# Altium schematic sheet SIM7100.SchDoc
size A4
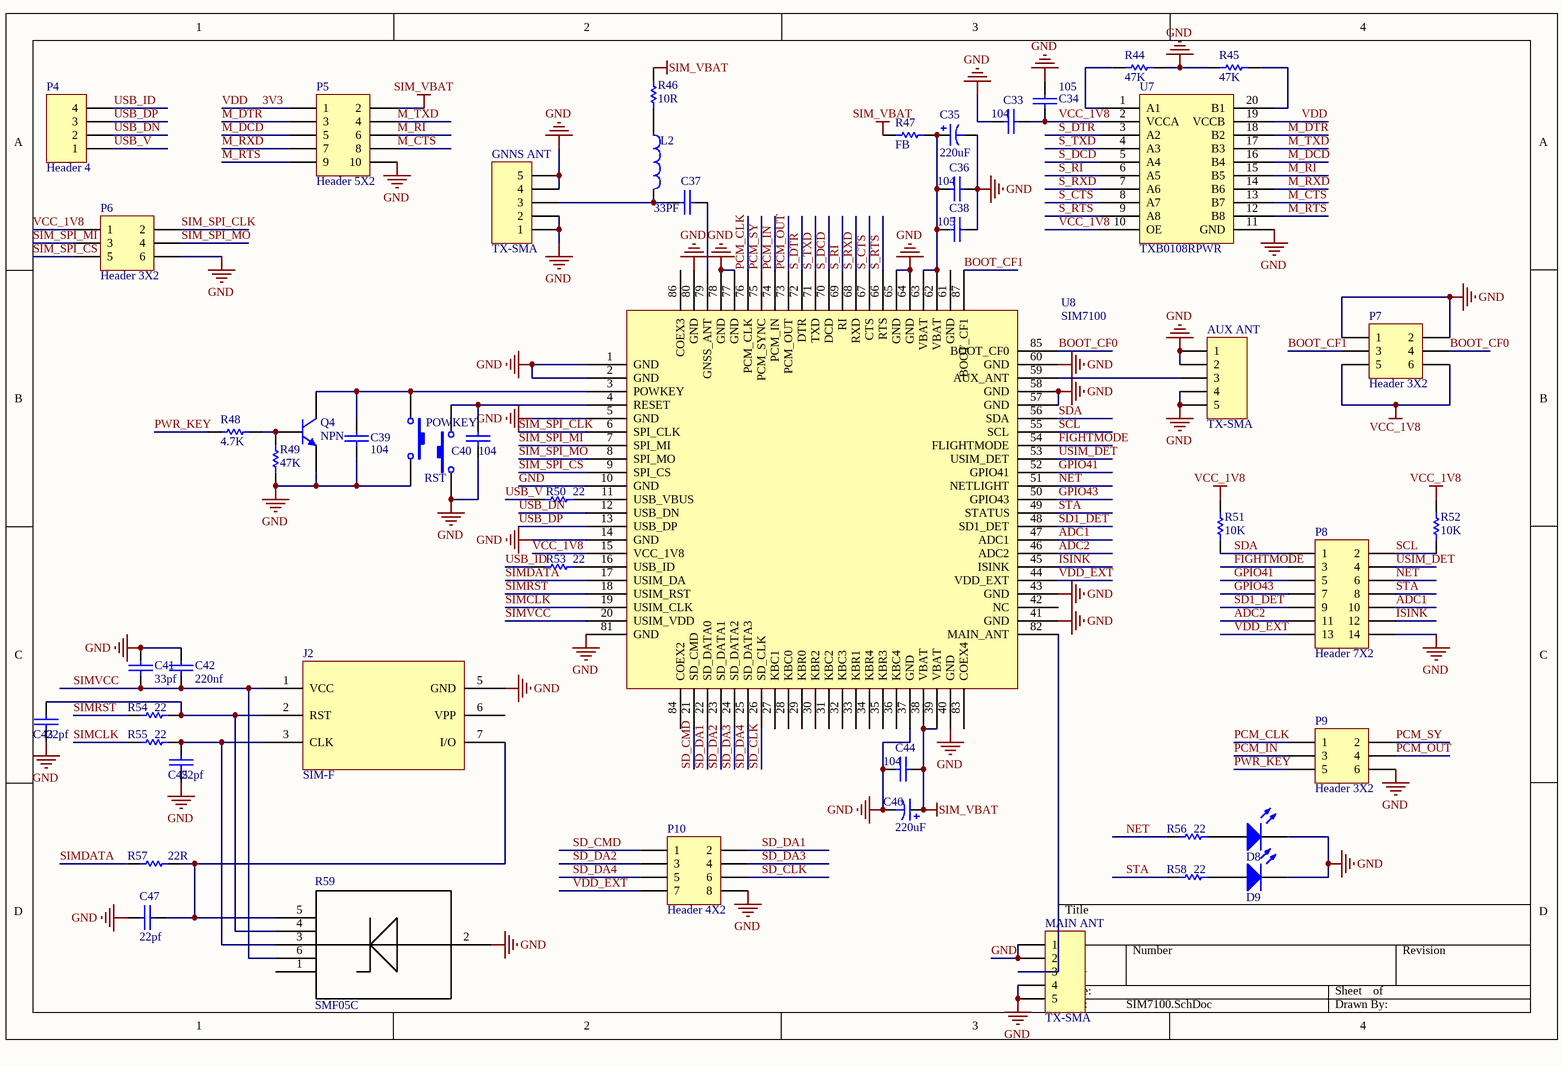
[diagram p0: SIM7100.SchDoc]

## Parts
AUX_ANT  TX-SMA  [SMA]
C33  104  [RC0805]
C34  105  [RC0805]
C35  value 220uF  [CAP(100uF)]  (hidden comment: 407uF)
C36  104  [RC0805]
C37  33PF  [RC0805]
C38  105  [RC0805]
C39  104  [RC0805]
C40  104  [RC0805]
C41  33pf  [RC0805]
C42  220nf  [RC0805]
C43  22pf  [RC0805]
C44  104  [RC0805]
C45  22pf  [RC0805]
C46  value 220uF  [CAP(100uF)]  (hidden comment: 407uF)
C47  22pf  [RC0805]
D8  LED0  [LED-0805]  (value not drawn)
D9  LED0  [LED-0805]  (value not drawn)
GNNS_ANT  TX-SMA  [SMA]
J2  SIM-F  [SIM_FG]
L2  Inductor  [RC0805]  (value not drawn)
MAIN_ANT  TX-SMA  [SMA]
P4  Header 4  [HDR1X4]
P5  Header 5X2  [HDR2X5]
P6  Header 3X2  [HDR2X3]
P7  Header 3X2  [HDR2X3]
P8  Header 7X2  [HDR2X7]
P9  Header 3X2  [HDR2X3]
P10  Header 4X2  [HDR2X4]
POWKEY  SW-PB  [小按键]  (value not drawn)
Q4  NPN  [to-92a]
R44  value 47K  [RC0805]  (hidden comment: Res1)
R45  value 47K  [RC0805]  (hidden comment: Res1)
R46  value 10R  [RC0805]  (hidden comment: Res1)
R47  value FB  [1206]  (hidden comment: Res1)
R48  value 4.7K  [RC0805]  (hidden comment: Res1)
R49  value 47K  [RC0805]  (hidden comment: Res1)
R50  value 22  [RC0805]  (hidden comment: Res1)
R51  value 10K  [RC0805]  (hidden comment: Res1)
R52  value 10K  [RC0805]  (hidden comment: Res1)
R53  value 22  [RC0805]  (hidden comment: Res1)
R54  value 22  [RC0805]  (hidden comment: Res1)
R55  value 22  [RC0805]  (hidden comment: Res1)
R56  value 22  [RC0805]  (hidden comment: Res1)
R57  value 22R  [RC0805]  (hidden comment: Res1)
R58  value 22  [RC0805]  (hidden comment: Res1)
R59  SMF05C  [SOT-363]
RST  SW-PB  [小按键]  (value not drawn)
U7  TXB0108RPWR  [R-PDSO-20]
U8  SIM7100  [SIM7100]

## Nets
GND: AUX_ANT.1 AUX_ANT.2 AUX_ANT.4 AUX_ANT.5 C33.1 C34.2 C35.2 C36.2 C38.2 C39.2 C40.2 C41.2 C42.2 C43.1 C44.1 C45.1 C46.2 C47.2 D8.2(K) D9.2(K) GNNS_ANT.1 GNNS_ANT.2 GNNS_ANT.4 GNNS_ANT.5 J2.5(GND) MAIN_ANT.1 MAIN_ANT.2 MAIN_ANT.4 MAIN_ANT.5 P5.10 P6.6 P7.1 P7.2 P8.14 P9.6 P10.8 POWKEY.2 Q4.1(E) R44.1 R45.2 R49.1 R59.2(I/O) RST.1 U7.11(GND) U8.1(GND) U8.2(GND) U8.5(GND) U8.10(GND) U8.14(GND) U8.37(GND) U8.40(GND) U8.41(GND) U8.43(GND) U8.57(GND) U8.58(GND) U8.60(GND) U8.64(GND) U8.65(GND) U8.77(GND) U8.78(GND) U8.80(GND) U8.81(GND)
SIM_VBAT: C44.2 C46.1 P5.2 R46.2 R47.1 U8.38(VBAT) U8.39(VBAT)
VCC_1V8: C33.2 C34.1 P6.1 P7.5 P7.6 R51.2 R52.2 U7.2(VCCA) U7.10(OE) U8.15(VCC_1V8)
3V3: P5.1 U7.19(VCCB)  [also labelled VDD]
ADC1: P8.10 U8.47(ADC1)
ADC2: P8.11 U8.46(ADC2)
BOOT_CF0: P7.4 U8.85(BOOT_CF0)
BOOT_CF1: P7.3 U8.87(BOOT_CF1)
FIGHTMODE: P8.3 U8.54(FLIGHTMODE)
GPIO41: P8.5 U8.52(GPIO41)
GPIO43: P8.7 U8.50(GPIO43)
ISINK: P8.12 U8.45(ISINK)
M_CTS: P5.8 U7.13(B7)
M_DCD: P5.5 U7.16(B4)
M_DTR: P5.3 U7.18(B2)
M_RI: P5.6 U7.15(B5)
M_RTS: P5.9 U7.12(B8)
M_RXD: P5.7 U7.14(B6)
M_TXD: P5.4 U7.17(B3)
NET: P8.6 R56.1 U8.51(NETLIGHT)
PCM_CLK: P9.1 U8.76(PCM_CLK)
PCM_IN: P9.3 U8.74(PCM_IN)
PCM_OUT: P9.4 U8.73(PCM_OUT)
PCM_SY: P9.2 U8.75(PCM_SYNC)
PWR_KEY: P9.5 R48.1
S_CTS: U7.8(A7) U8.67(CTS)
S_DCD: U7.5(A4) U8.70(DCD)
S_DTR: U7.3(A2) U8.72(DTR)
S_RI: U7.6(A5) U8.69(RI)
S_RTS: U7.9(A8) U8.66(RTS)
S_RXD: U7.7(A6) U8.68(RXD)
S_TXD: U7.4(A3) U8.71(TXD)
SCL: P8.2 R52.1 U8.55(SCL)
SD1_DET: P8.9 U8.48(SD1_DET)
SD_CLK: P10.6 U8.26(SD_CLK)
SD_CMD: P10.1 U8.21(SD_CMD)
SD_DA1: P10.2 U8.22(SD_DATA0)
SD_DA2: P10.3 U8.23(SD_DATA1)
SD_DA3: P10.4 U8.24(SD_DATA2)
SD_DA4: P10.5 U8.25(SD_DATA3)
SDA: P8.1 R51.1 U8.56(SDA)
SIM_SPI_CLK: P6.2 U8.6(SPI_CLK)
SIM_SPI_CS: P6.5 U8.9(SPI_CS)
SIM_SPI_MI: P6.3 U8.7(SPI_MI)
SIM_SPI_MO: P6.4 U8.8(SPI_MO)
SIMCLK: R55.1 U8.19(USIM_CLK)
SIMDATA: R57.1 U8.17(USIM_DA)
SIMRST: R54.1 U8.18(USIM_RST)
SIMVCC: C41.1 C42.1 J2.1(VCC) R59.6(I/O) U8.20(USIM_VDD)
STA: P8.8 R58.1 U8.49(STATUS)
USB_DN: P4.2 U8.12(USB_DN)
USB_DP: P4.3 U8.13(USB_DP)
USB_ID: P4.4 R53.1
USB_V: P4.1 R50.1
USIM_DET: P8.4 U8.53(USIM_DET)
VDD_EXT: P8.13 P10.7 U8.44(VDD_EXT)
NetAUX_ANT_3: AUX_ANT.3 U8.59(AUX_ANT)
NetC35_1: C35.1 C36.1 C38.1 R47.2 U8.62(VBAT) U8.63(VBAT)
NetC37_1: C37.1 GNNS_ANT.3 L2.2
NetC37_2: C37.2 U8.79(GNSS_ANT)
NetC39_1: C39.1 POWKEY.1 Q4.3(C) U8.3(POWKEY)
NetC40_1: C40.1 RST.2 U8.4(RESET)
NetC43_2: C43.2 J2.2(RST) R54.2 R59.4(I/O)
NetC45_2: C45.2 J2.3(CLK) R55.2 R59.3(I/O)
NetC47_1: C47.1 J2.7(I/O) R57.2 R59.5(I/O)
NetD8_1: D8.1(A) R56.2
NetD9_1: D9.1(A) R58.2
NetL2_1: L2.1 R46.1
NetMAIN_ANT_3: MAIN_ANT.3 U8.82(MAIN_ANT)
NetQ4_2: Q4.2(B) R48.2 R49.2
NetR44_2: R44.2 U7.1(A1)
NetR45_1: R45.1 U7.20(B1)
NetR50_2: R50.2 U8.11(USB_VBUS)
NetR53_2: R53.2 U8.16(USB_ID)

Not connected (* = marked no-connect by the designer): J2 6(VPP); R59 1(I/O); U8 27(KBC1) 28(KBC0) 29(KBR0) 30(KBR2) 31(KBC2) 32(KBC3) 33(KBR1) 34(KBR4) 35(KBR3) 36(KBC4) 42(NC) 61(GND) 83(COEX4) 84(COEX2) 86(COEX3)

## Library data of the parts
AUX_ANT GNNS_ANT MAIN_ANT = Header 5: Header, 5-Pin; LatestRevisionDate: 17-Jul-2002; LatestRevisionNote: Re-released for DXP Platform.; Publisher: Altium Limited
C33 C34 C36-C45 C47 = CAP: Capacitor
C35 C46 = Cap Pol1: Polarized Capacitor (Radial); Published: 8-Jun-2000; LatestRevisionDate: 17-Jul-2002; LatestRevisionNote: Re-released for DXP Platform.; PackageReference: RB7.6-15; Publisher: Altium Limited
D8 D9 = LED0: Typical INFRARED GaAs LED; Published: 8-Jun-2000; LatestRevisionDate: 08-Jul-2005; LatestRevisionNote: Mech Layer 1 removed.; PackageReference: LED-0; Publisher: Altium Limited; PackageDescription: LED; 2 Leads
L2 = Inductor: Code_IEC: 1005; Value: 10mH; Published: 8-Jun-2000; LatestRevisionDate: 29-May-2009; LatestRevisionNote: IPC-7351 Footprint Added.; PackageReference: 0402-A; Publisher: Altium Limited; PackageDescription: Chip Inductor; Code_JEITA: 0402
P4 = Header 4: Header, 4-Pin; LatestRevisionDate: 17-Jul-2002; LatestRevisionNote: Re-released for DXP Platform.; Publisher: Altium Limited
P5 = Header 5X2: Header, 5-Pin, Dual row; LatestRevisionDate: 17-Jul-2002; LatestRevisionNote: Re-released for DXP Platform.; Publisher: Altium Limited
P6 P7 P9 = Header 3X2: Header, 3-Pin, Dual row; LatestRevisionDate: 17-Jul-2002; LatestRevisionNote: Re-released for DXP Platform.; Publisher: Altium Limited
P8 = Header 7X2: Header, 7-Pin, Dual row; LatestRevisionDate: 17-Jul-2002; LatestRevisionNote: Re-released for DXP Platform.; Publisher: Altium Limited
P10 = Header 4X2: Header, 4-Pin, Dual row; LatestRevisionDate: 17-Jul-2002; LatestRevisionNote: Re-released for DXP Platform.; Publisher: Altium Limited
POWKEY RST = SW-PB: Switch; Published: 24-Mar-1999; LatestRevisionDate: 17-Jul-2002; LatestRevisionNote: Re-released for DXP Platform.; PackageReference: SPST-2; Publisher: Altium Limited; PackageDescription: Switch; 2 Leads
Q4 = 2N3904: NPN General Purpose Amplifier; Published: 8-Jun-2000; LatestRevisionDate: 15-Jan-2003; LatestRevisionNote: PCB Footprint 'BCY-W3/D4.7' replaced; DatasheetVersion: 1997; PackageVersion: Sep-1998; PackageReference: TO-92A; Publisher: Altium Limited; PackageDescription: TO, Flat Index; 3 In-Line, Axial Leads; Body Dia. 4.5mm; Leads 0.51 x 0.48 mm (max); ComponentLink1Description: Manufacturer Link; ComponentLink1URL: http://www.fairchildsemi.com/; ComponentLink2Description: Datasheet; ComponentLink2URL: http://www.fairchildsemi.com/ds/2N%2F2N3904.pdf
R44-R58 = Res1: Resistor; Published: 8-Jun-2000; LatestRevisionDate: 17-Jul-2002; LatestRevisionNote: Re-released for DXP Platform.; PackageReference: AXIAL-0.3; Publisher: Altium Limited; PackageDescription: Axial Device, Thru-Hole; 2 Leads; 0.3 in Pin Spacing